# Altium schematic sheet USB_port.SchDoc: USB connector and ESD protection circuit
size A4; SheetNumber: 11; SheetTotal: 18; TitleBig: USB connector and ESD protection circuit; Desc_line1: USB is used as a programming interface, as well as a power source for the charging circuit. Since it's an external; Desc_line2: connector, it needs to have a protection circuit against electro-static discharge (ESD) and noise.
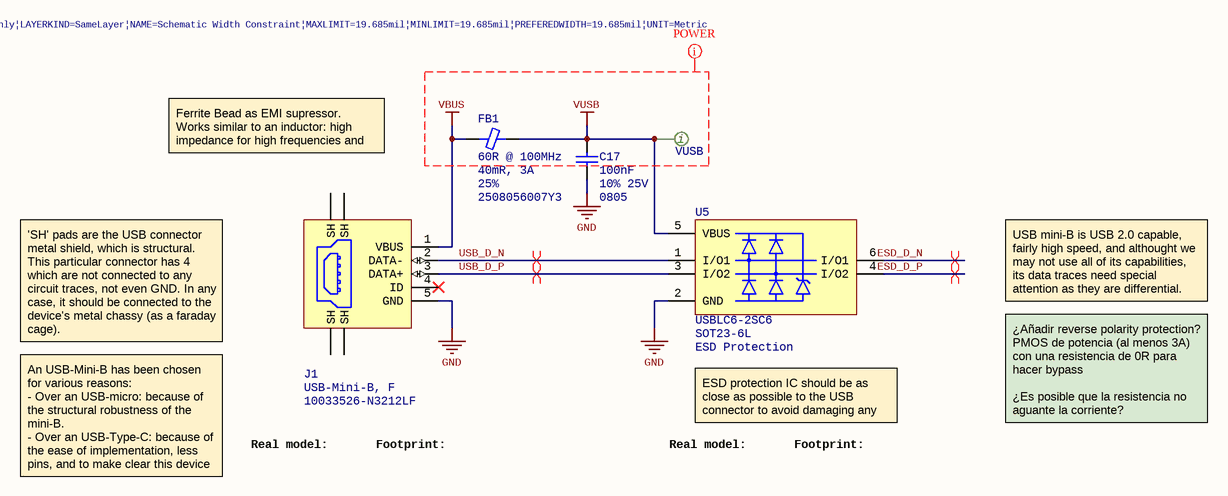
[diagram p0: USB_port.SchDoc]

## Parts
C17  value 100nF  Tolerance: 10% 25V  PackageDescription: 0805  [CAP 0805_2012]  (hidden comment: Cap_cer_0805)
FB1  value 40mR, 3A  Desc: 60R @ 100MHz  Tolerance: 25%  Part: 2508056007Y3  [FER 0805_2012]  (hidden comment: Ferrite Bead Chip Fair-Rite 2508056007Y3)
J1  PackageDescription: USB-Mini-B, F  Part: 10033526-N3212LF  [FCI USB Type B Mini 10033526-N3212LF]  (hidden comment: USB-MINI-B Female)
U5  Part: USBLC6-2SC6  PackageDescription: SOT23-6L  Type: ESD Protection  [SOT-23-6L USBLC6-2SC6]  (hidden comment: IC USBLC6-2SC6 ESD Prot)
VUSB  Test Point Pad dual sided  [TEST POINT PAD]  (value not drawn)

## Nets
GND: C17.1 J1.5(GND) U5.2(GND)
VBUS: FB1.1 J1.1(VBUS)
VUSB: C17.2 FB1.2 U5.5(VBUS) VUSB.1
ESD_D_N: U5.6(I/O1)
ESD_D_P: U5.4(I/O2)
USB_D_N: J1.2(DATA-) U5.1(I/O1)
USB_D_P: J1.3(DATA+) U5.3(I/O2)

Not connected (* = marked no-connect by the designer): J1 4(ID)* 6(SH) 7(SH) 8(SH) 9(SH)

## Layout directives
differential pair: ESD_D_N, ESD_D_P, USB_D_N, USB_D_P
net class POWER; rule Width Constraint [Pref Width = 0.5mm    Min Width = 0.5mm    Max Width = 0.5mm]: VBUS, VUSB

## Notes on the sheet
- Ferrite Bead as EMI supressor. Works similar to an inductor: high impedance for high frequencies and very low for DC
- 'SH' pads are the USB connector metal shield, which is structural. This particular connector has 4 which are not connected to any circuit traces, not even GND. In any case, it should be connected to the device's metal chassy (as a faraday cage).
- USB mini-B is USB 2.0 capable, fairly high speed, and althought we may not use all of its capabilities, its data traces need special attention as they are differential.
- ESD protection IC should be as close as possible to the USB connector to avoid damaging any other circuits.
- ¿Añadir reverse polarity protection?
  PMOS de potencia (al menos 3A) con una resistencia de 0R para hacer bypass
  ¿Es posible que la resistencia no aguante la corriente?
- An USB-Mini-B has been chosen for various reasons:
  - Over an USB-micro: because of the structural robustness of the mini-B.
  - Over an USB-Type-C: because of the ease of implementation, less pins, and to make clear this device is not a host.
- Real model:
- Footprint:
- Designer's signature
- Sheet title:
- Sr. Andrés Roldán Aranda
- Supervisor:
- Supervisor's signature
- Project title:
- Desginer:
- Dpto. Electrónica y Tecnología
- de Computadores
- University of Granada
- C/ Fuente Nueva, s/n, 18001
- Granada, Granada, Spain
- Date:
- Revision:
- Sheet
- of
- (in symbol Test Point Pad dual sided) i

## Library data of the parts
C17 = Cap_cer_0805_100nF_10%: Ceramic cap size 0805
FB1 = Ferrite Bead Chip Fair-Rite 2508056007Y3: 0805, 60Ω, 3A, 25% SMT
J1 = CON USB-MINI-B Female: USB-MINI-B Female, Manufacturer PN/ID: 10033526-N3212LF
U5 = IC USBLC6-2SC6 ESD Prot: Very low capacitance ESD protection; Value: *
VUSB = Test Point Pad dual sided: Test point - PCB Pad dual sided